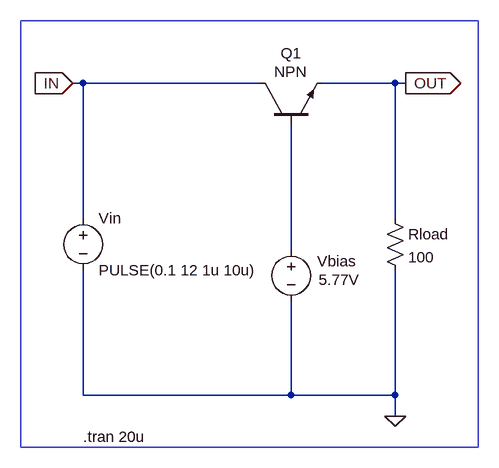
[diagram p0: schematic Switch-Mode_Power_Supplies_-_Basso-_Figure_1-4a.asc]
Switch-Mode_Power_Supplies_-_Basso-_Figure_1-4a.asc, the LTspice schematic file:
Version 4
SHEET 1 880 848
WIRE -448 128 -464 128
WIRE -176 128 -448 128
WIRE 32 128 -80 128
WIRE 48 128 32 128
WIRE -448 336 -448 128
WIRE 32 336 32 128
WIRE -128 384 -128 192
WIRE -448 608 -448 416
WIRE -128 608 -128 464
WIRE -128 608 -448 608
WIRE 32 608 32 416
WIRE 32 608 -128 608
WIRE 32 640 32 608
FLAG 32 640 0
FLAG 48 128 OUT
IOPIN 48 128 Out
FLAG -464 128 IN
IOPIN -464 128 In
SYMBOL voltage -128 368 R0
WINDOW 123 0 0 Left 0
WINDOW 39 0 0 Left 0
WINDOW 0 40 34 Left 0
WINDOW 3 42 62 Left 0
SYMATTR InstName Vbias
SYMATTR Value 5.77V
SYMBOL npn -176 192 R270
WINDOW 0 110 32 VRight 0
WINDOW 3 82 22 VRight 0
SYMATTR InstName Q1
SYMBOL res 16 320 R0
SYMATTR InstName Rload
SYMATTR Value 100
SYMBOL voltage -448 320 R0
WINDOW 123 0 0 Left 0
WINDOW 39 0 0 Left 0
SYMATTR InstName Vin
SYMATTR Value PULSE(0.1 12 1u 10u)
TEXT -448 672 Left 0 !.tran 20u
RECTANGLE Normal 160 688 -544 32

The netlist it stands for:
* Switch-Mode_Power_Supplies_-_Basso-_Figure_1-4a.asc
Vbias N001 0 5.77V
Q1 IN N001 OUT 0 NPN
Rload OUT 0 100
Vin IN 0 PULSE(0.1 12 1u 10u)
.model NPN NPN
.model PNP PNP
.lib standard.bjt
.tran 20u
.backanno
.end